# Altium schematic sheet Rajesh_Jasti_17978253_Lab_1.SchDoc
size A4; DrawnBy: Rajesh Jasti; Revision: Prototype; SheetNumber: 1; SheetTotal: 1
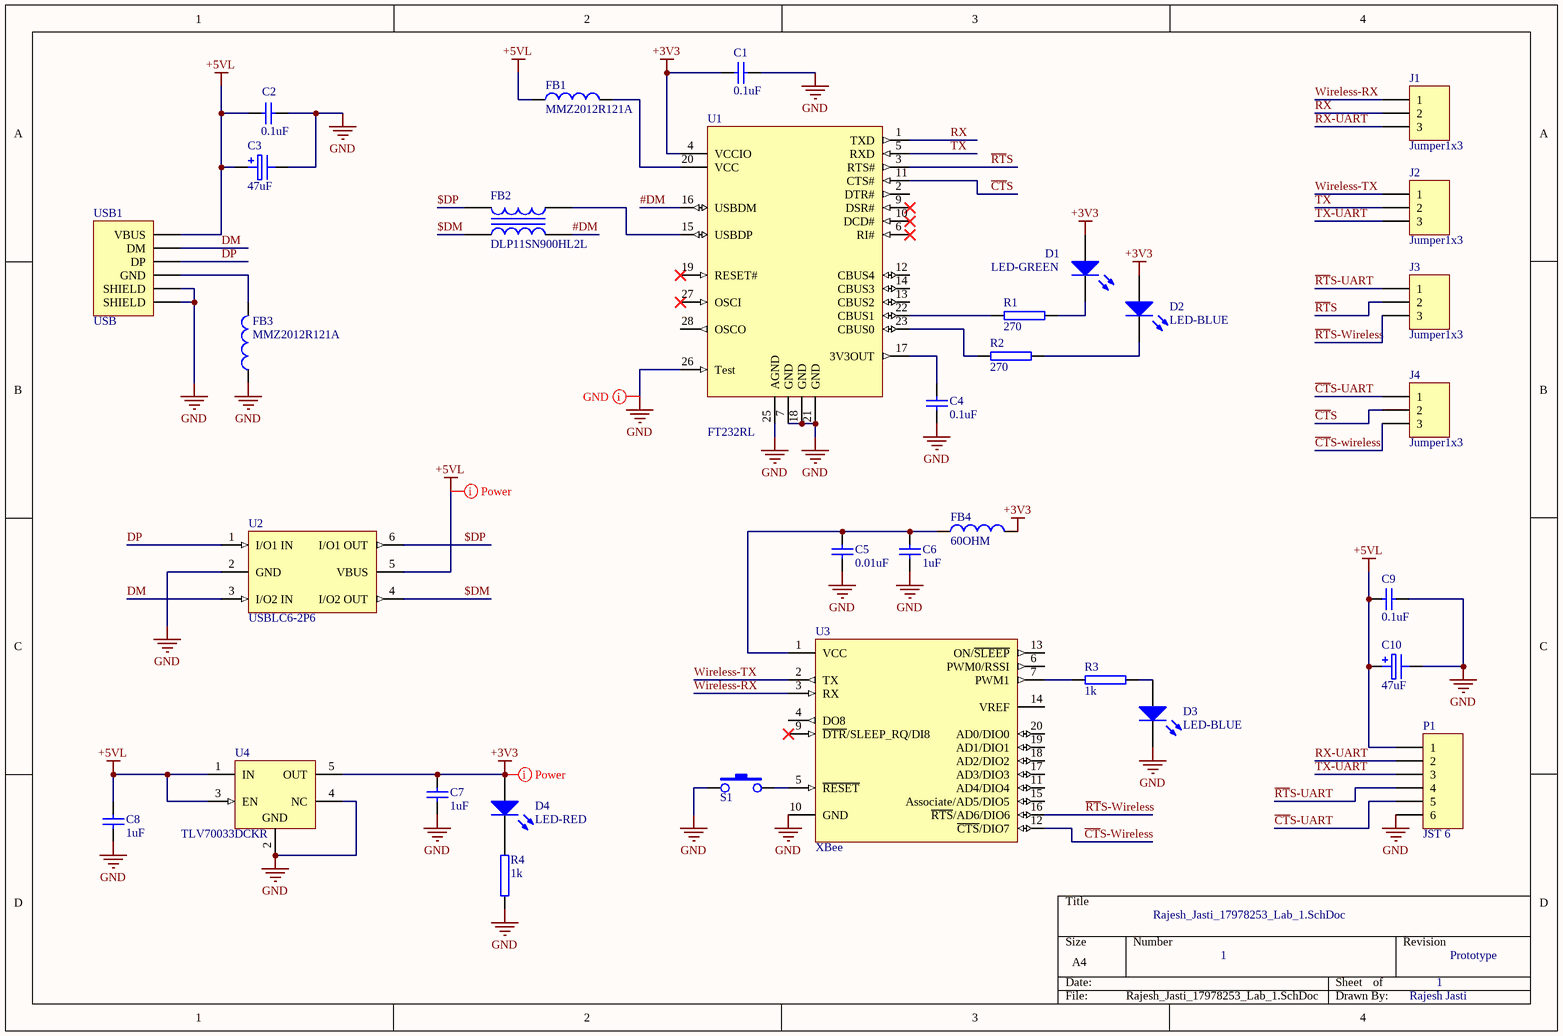
[diagram p0: Rajesh_Jasti_17978253_Lab_1.SchDoc]

## Parts
C1  0.1uF  [CAP_0805]
C2  0.1uF  [CAP_0805]
C3  47uF  [CAPTAN-A]
C4  0.1uF  [CAP_0805]
C5  0.01uF  [CAP_0805]
C6  1uF  [CAP_0805]
C7  1uF  [CAP_0805]
C8  1uF  [CAP_0805]
C9  0.1uF  [CAP_0805]
C10  47uF  [CAPTAN-A]
D1  LED-GREEN  [LED0805G]
D2  LED-BLUE  [LED0805B]
D3  LED-BLUE  [LED0805B]
D4  LED-RED  [LED0805R]
FB1  MMZ2012R121A  [0805]
FB2  DLP11SN900HL2L  [0504]
FB3  MMZ2012R121A  [0805]
FB4  60OHM  [0805]
J1  Jumper1x3  [Jumper1x3]
J2  Jumper1x3  [Jumper1x3]
J3  Jumper1x3  [Jumper1x3]
J4  Jumper1x3  [Jumper1x3]
P1  JST 6  [PA-6]
R1  270  [RES_0805]
R2  270  [RES_0805]
R3  1k  [RES_0805]
R4  1k  [RES_0805]
S1  147873-2  [147873-2]  (value not drawn)
U1  FT232RL  [SSOP28W]
U2  USBLC6-2P6  [SOT666]
U3  XBee  [XBee]
U4  TLV70033DCKR  [SC70-5]
USB1  USB  [USB-A Plug]

## Nets
+3V3: C1.1 C7.2 D1.A D2.A D4.A FB4.2 U1.4(VCCIO) U4.5(OUT)
+5VL: C2.1 C3.1 C8.2 C9.1 C10.1 FB1.1 P1.1 U2.5(VBUS) U4.1(IN) U4.3(EN) USB1.1(VBUS)
GND: C1.2 C2.2 C3.2 C4.1 C5.1 C6.1 C7.1 C8.1 C9.2 C10.2 D3.K FB3.1 P1.6 R4.1 S1.1 U1.7(GND) U1.18(GND) U1.21(GND) U1.25(AGND) U1.26(Test) U2.2(GND) U3.10(GND) U4.2(GND) U4.4(NC) USB1.5(SHIELD) USB1.6(SHIELD)
#DM: FB2.3 U1.16(USBDM)
$DM: FB2.4 U2.4(I/O2_OUT)
$DP: FB2.1 U2.6(I/O1_OUT)
~{CT}S: J4.2 U1.11(CTS#)
~{CT}S-UART: J4.1 P1.5
~{CT}S-Wireless: J4.3 U3.12(~{CTS}/DIO7)
DM: U2.3(I/O2_IN) USB1.2(DM)
DP: U2.1(I/O1_IN) USB1.3(DP)
~{RT}S: J3.2 U1.3(RTS#)
~{RT}S-UART: J3.1 P1.4
~{RT}S-Wireless: J3.3 U3.16(~{RTS}/AD6/DIO6)
RX: J1.2 U1.1(TXD)
RX-UART: J1.3 P1.2
TX: J2.2 U1.5(RXD)
TX-UART: J2.3 P1.3
Wireless-RX: J1.1 U3.3(RX)
Wireless-TX: J2.1 U3.2(TX)
NetC4_2: C4.2 U1.17(3V3OUT)
NetC5_2: C5.2 C6.2 FB4.1 U3.1(VCC)
NetD1_K: D1.K R1.2
NetD2_K: D2.K R2.2
NetD3_A: D3.A R3.2
NetD4_K: D4.K R4.2
NetFB1_2: FB1.2 U1.20(VCC)
NetFB2_2: FB2.2 U1.15(USBDP)
NetFB3_2: FB3.2 USB1.4(GND)
NetR1_1: R1.1 U1.22(CBUS1)
NetR2_1: R2.1 U1.23(CBUS0)
NetR3_1: R3.1 U3.7(PWM1)
NetS1_2: S1.2 U3.5(~{RESET})

Not connected (* = marked no-connect by the designer): U1 2(DTR#) 6(RI#)* 8(NC) 9(DSR#)* 10(DCD#)* 12(CBUS4) 13(CBUS2) 14(CBUS3) 19(RESET#)* 24(NC) 27(OSCI)* 28(OSCO); U3 4(DO8) 6(PWM0/RSSI) 8(NC) 9(~{DTR}/SLEEP_RQ/DI8)* 11(AD4/DIO4) 13(ON/~{SLEEP}) 14(VREF) 15(Associate/AD5/DIO5) 17(AD3/DIO3) 18(AD2/DIO2) 19(AD1/DIO1) 20(AD0/DIO0)

## Layout directives
rule Clearance Constraint [Clearance = 10mil]; rule Width Constraint [Pref Width = 15mil    Min Width = 9mil    Max Width = 30mil]: +3V3, +5VL, GND

## Library data of the parts
C1 C2 C4-C9 = CAPN 0805: Non Polarized Capacitor, SMD, 0805
C3 C10 = CAPP Tan A: Polarized  Tantalum Capacitor, SMD, Size A
D1 = SMD 0805 LED-GREEN: GREEN  LED,Case 0805; Supplier 1: Farnell; Supplier Part Number 1: 1716766
D2 D3 = SMD 0805 LED-BLUE: BLUE LED, Case 0805; Supplier 1: Farnell; Supplier Part Number 1: 1850746
D4 = SMD 0805 LED-RED: RED LED, Case 0805; Supplier 1: Farnell; Supplier Part Number 1: 1581239
FB1 FB3 = MMZ2012R121A: Choke, 800mA; Supplier 1: Farnell; Supplier Part Number 1: 1669720
FB2 = DLP11SN900HL2L: Choke, 150mA, 90ohm at 100MHz; Supplier 1: Farnell; Supplier Part Number 1: 2443262
FB4 = BLM21PG600SN1D: Choke, 3A, 60ohm at 100MHz; Supplier 1: Farnell; Supplier Part Number 1: 1515665
J1-J4 = Jumper1x3: Header, Plug, 2.54mm, 3 Pins, Right Angle
P1 = JST PA Header 6: JST PA Header, 6-Pin, Pitch 2mm; Supplier 1: Farnell; Supplier Part Number 1: 1830742
R1-R4 = Resistor 0805: Resistor, SMD, 0805
S1 = 147873-2: Momentary Contact Switch; Supplier 1: Mouser; Supplier Part Number 1: 506-147873-2
U1 = FT232RL: FTDI - FT232RL - USB TO UART, SMD; Supplier 1: Farnell; Supplier Part Number 1: 1146032
U2 = USBLC6-2P6: Very  Loe Capactance ESD Protection; Supplier 1: Farnell; Supplier Part Number 1: 1295310
U3 = XBee: XBee/XBee-PRO RF Modules; Supplier 1: Farnell; Supplier Part Number 1: 1337912
U4 = TLV70033DCKR: Single Output LDO, 200 mA, Fixed 3.3 V Output, 2 to 5.5 V Input, with Low IQ, 5-pin SC70 (DCK), -40 to 125 degC, Green (RoHS & no Sb/Br); Supplier 1: Digi-Key; Supplier Part Number 1: 296-32413-1-ND
USB1 = USB-A/Plug: USB TYPE A CONNECTOR Plug 4POS SMD; Supplier 1: Element14; Supplier Part Number 1: 1308875